# Altium schematic sheet mosfet.SchDoc
size A
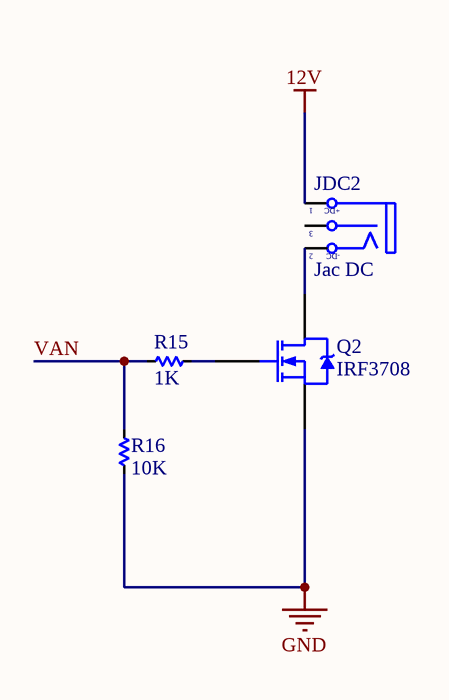
[diagram p0: mosfet.SchDoc]

## Parts
JDC2  Jac DC  [DC3]
Q2  IRF3708  [TO-252AA_N]
R15  1K  [RES-SMD-0805]
R16  10K  [RES-SMD-0805]

## Nets
12V: JDC2.1(T)
GND: Q2.3(S) R16.2
VAN: R15.1 R16.1
NetJDC2_2: JDC2.2(TN) Q2.4(D)
NetQ2_1: Q2.1(G) R15.2

Not connected (* = marked no-connect by the designer): JDC2 3(S)

## Notes on the sheet
- (in symbol DCIN) +DC; -DC

## Library data of the parts
JDC2 = DCIN: Jac DC input; Value: Jac DC
Q2 = IRFR3911: HEXFET Power MOSFET; Note: Pin 2 is trimmed and not drawn; Published: 17-Sep-2003; LatestRevisionDate: 20-Nov-2009; LatestRevisionNote: IPC-7351 Footprint Added.; DatasheetVersion: 22-Jan-2002; PackageVersion: Feb-2003; PackageReference: TO-252AA; Publisher: Altium Limited; PackageDescription: 3-Pin HEXFET Package 2.28 mm Pitch, 9.9 mm Lead Span; Code_JEDEC: TO-252-AA; ComponentLink1Description: Manufacturer Link; ComponentLink1URL: http://www.irf.com/; ComponentLink2Description: Datasheet; ComponentLink2URL: http://www.irf.com/product-info/datasheets/data/irfr3911.pdf
R15 R16 = Res-SMD: Resistor; Manufacturer: Generic Components; Class: Passive; Published: 08/06/2000; Publisher: Altium Hobart Technology Centre